# Altium schematic sheet Actuators.SchDoc
size A
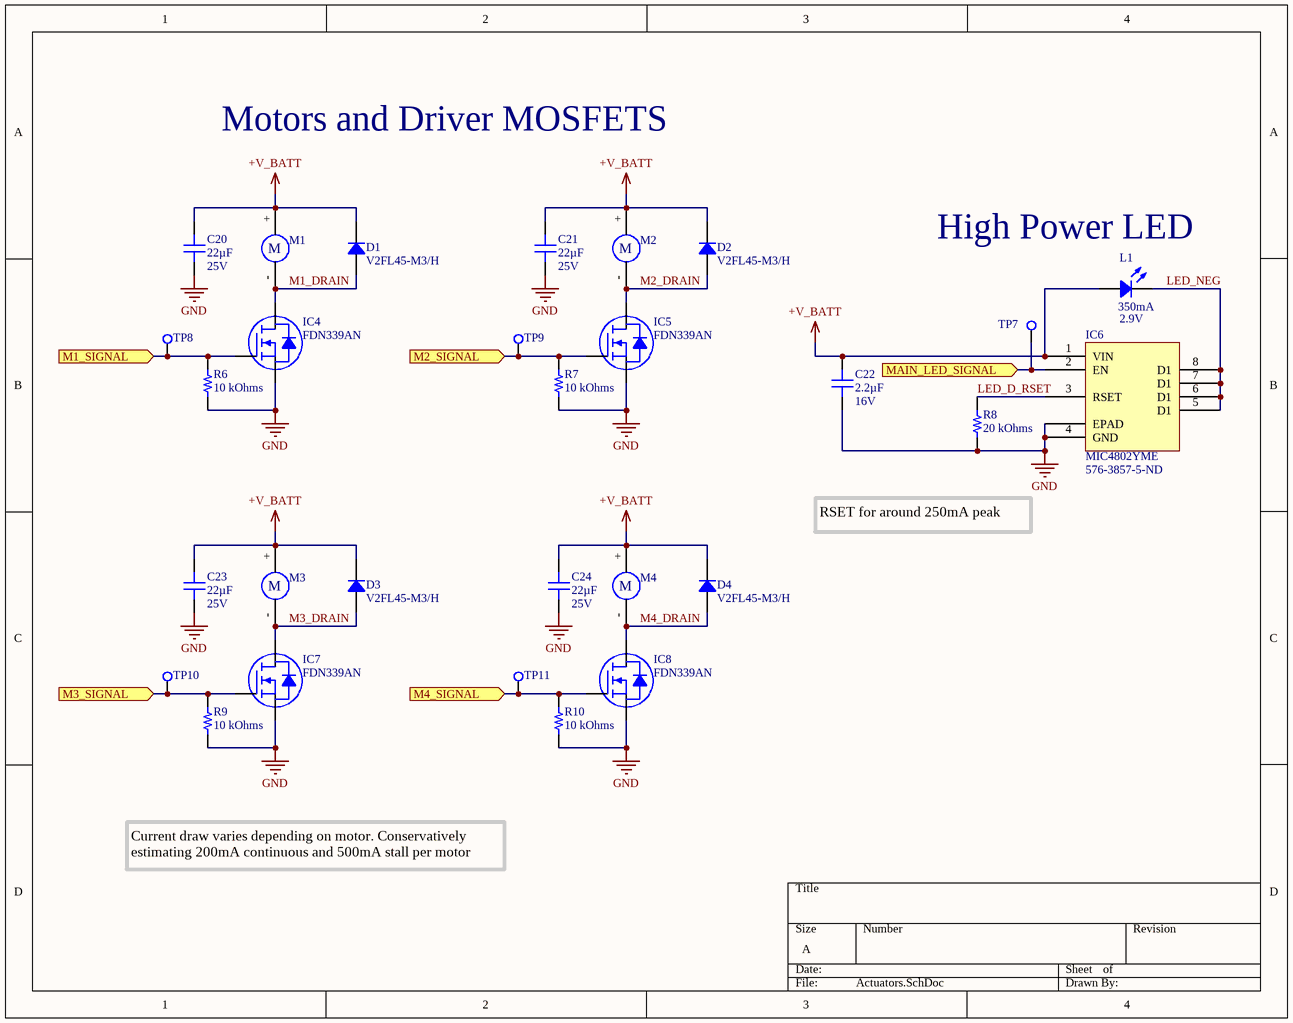
[diagram p0: Actuators.SchDoc]

## Parts
C20  Voltage - Rated: 25V  [CAP 1206_3216 - 1.8MM]  (hidden comment: 22µF)
C21  Voltage - Rated: 25V  [CAP 1206_3216 - 1.8MM]  (hidden comment: 22µF)
C22  Voltage - Rated: 16V  [CAP 0603_1608]  (hidden comment: 2.2µF)
C23  Voltage - Rated: 25V  [CAP 1206_3216 - 1.8MM]  (hidden comment: 22µF)
C24  Voltage - Rated: 25V  [CAP 1206_3216 - 1.8MM]  (hidden comment: 22µF)
D1  V2FL45-M3/H  [SMF DO-219AB]
D2  V2FL45-M3/H  [SMF DO-219AB]
D3  V2FL45-M3/H  [SMF DO-219AB]
D4  V2FL45-M3/H  [SMF DO-219AB]
IC4  FDN339AN  [ON SEMI SOT-23-3]
IC5  FDN339AN  [ON SEMI SOT-23-3]
IC6  MIC4802YME  Supplier Part Number 1: 576-3857-5-ND  [SOIC127P610X160_HS-9N]
IC7  FDN339AN  [ON SEMI SOT-23-3]
IC8  FDN339AN  [ON SEMI SOT-23-3]
L1  Test Current: 350mA  Forward Voltage: 2.9V  [LED]  (hidden comment: SCP9WTF1HEL1WKG34E)
M1  Motor Header  [Motor Header]  (value not drawn)  (no BOM)
M2  Motor Header  [Motor Header]  (value not drawn)  (no BOM)
M3  Motor Header  [Motor Header]  (value not drawn)  (no BOM)
M4  Motor Header  [Motor Header]  (value not drawn)  (no BOM)
R6  10 kOhms  [RES 0603_1608]
R7  10 kOhms  [RES 0603_1608]
R8  20 kOhms  [RES 0603_1608]
R9  10 kOhms  [RES 0603_1608]
R10  10 kOhms  [RES 0603_1608]
TP7  TestPoint  [TestPoint]  (value not drawn)  (no BOM)
TP8  TestPoint  [TestPoint]  (value not drawn)  (no BOM)
TP9  TestPoint  [TestPoint]  (value not drawn)  (no BOM)
TP10  TestPoint  [TestPoint]  (value not drawn)  (no BOM)
TP11  TestPoint  [TestPoint]  (value not drawn)  (no BOM)

## Ports
M1_SIGNAL (in), M2_SIGNAL (in), M3_SIGNAL (in), M4_SIGNAL (in), MAIN_LED_SIGNAL (in)

## Nets
+V_BATT: C20.2 C21.2 C22.2 C23.2 C24.2 D1.2 D2.2 D3.2 D4.2 IC6.1(VIN) L1.Anode M1.+ M2.+ M3.+ M4.+
GND: C20.1 C21.1 C22.1 C23.1 C24.1 IC4.2(S) IC5.2(S) IC6.4(GND) IC6.EPAD IC7.2(S) IC8.2(S) R6.1 R7.1 R8.1 R9.1 R10.1
LED_D_RSET: IC6.3(RSET) R8.2
LED_NEG: IC6.5(D1) IC6.6(D1) IC6.7(D1) IC6.8(D1) L1.Cathode
M1_DRAIN: D1.1 IC4.3(D) M1.-
M1_SIGNAL: IC4.1(G) R6.2 TP8.1 ; port M1_SIGNAL
M2_DRAIN: D2.1 IC5.3(D) M2.-
M2_SIGNAL: IC5.1(G) R7.2 TP9.1 ; port M2_SIGNAL
M3_DRAIN: D3.1 IC7.3(D) M3.-
M3_SIGNAL: IC7.1(G) R9.2 TP10.1 ; port M3_SIGNAL
M4_DRAIN: D4.1 IC8.3(D) M4.-
M4_SIGNAL: IC8.1(G) R10.2 TP11.1 ; port M4_SIGNAL
MAIN_LED_SIGNAL: IC6.2(EN) TP7.1 ; port MAIN_LED_SIGNAL

## Notes on the sheet
- Motors and Driver MOSFETS
- (near L1) High Power LED
- RSET for around 250mA peak
- Current draw varies depending on motor. Conservatively estimating 200mA continuous and 500mA stall per motor
- (in symbol Motor Header) M

## Library data of the parts
C20 C21 C23 C24 = C3216X5R1E226M160AB: CAP CER 22UF 25V X5R 1206; Manufacturer: TDK Corporation; Tolerance: ±20%; Part Number: C3216X5R1E226M160AB; Value: 22µF; Applications: General Purpose; Capacitance: 22µF; ComponentLink1Description: Datasheet; ComponentLink1URL: https://product.tdk.com/info/en/catalog/datasheets/mlcc_commercial_general_en.pdf?ref_disty=digikey; ComponentLink2Description: DigiKey Link; ComponentLink2URL: http://digikey.com/product-detail/en/tdk-corporation/C3216X5R1E226M160AB/445-6000-1-ND/2444041; Device Package: 1206 (3216 Metric); Features: Low ESL; LastUpdated: 9/2/2020 1:05:36 AM; Lifecycle Status: Active; Minimum Order: 1; Mounting Type: Surface Mount, MLCC; Operating Temperature: -55°C ~ 85°C; Package / Case: 1206 (3216 Metric); Packaging: TapeAndReel; PartId: 21231; Part Status: Active; Price: 0.35; Series: C; Size / Dimension: 0.126" L x 0.063" W (3.20mm x 1.60mm); Supplier 1: DigiKey; Supplier Part Number 1: 445-6000-1-ND; Temperature Coefficient: X5R; Thickness (Max): 0.071" (1.80mm)
C22 = CC0603KRX5R7BB225: CAP CER 2.2UF 16V X5R 0603; Manufacturer: Yageo; Tolerance: ±10%; Part Number: CC0603KRX5R7BB225; Value: 2.2µF; Applications: General Purpose; Capacitance: 2.2µF; ComponentLink1Description: Datasheet; ComponentLink1URL: https://www.yageo.com/upload/media/product/productsearch/datasheet/mlcc/UPY-GPHC_X5R_4V-to-50V_25.pdf; ComponentLink2Description: DigiKey Link; ComponentLink2URL: http://digikey.com/product-detail/en/yageo/CC0603KRX5R7BB225/311-1784-1-ND/5195686; Device Package: 0603 (1608 Metric); LastUpdated: 9/2/2020 1:03:11 AM; Lifecycle Status: Active; Minimum Order: 1; Mounting Type: Surface Mount, MLCC; Operating Temperature: -55°C ~ 85°C; Package / Case: 0603 (1608 Metric); Packaging: TapeAndReel; PartId: 15051; Part Status: Active; Price: 0.03; Series: CC; Size / Dimension: 0.063" L x 0.031" W (1.60mm x 0.80mm); Supplier 1: DigiKey; Supplier Part Number 1: 311-1784-1-ND; Temperature Coefficient: X5R; Thickness (Max): 0.035" (0.90mm)
D1-D4 = V2FL45-M3/H: 2A,45V,SMF,TRENCH SKY RECT.; Manufacturer: Vishay Semiconductor Diodes Division; Capacitance @ Vr, F: 270pF @ 4V, 1MHz; Current - Reverse Leakage @ Vr: 570µA @ 45V; Diode Type: Schottky; Speed: Fast Recovery =< 500ns, > 200mA (Io); Voltage - Forward (Vf) (Max) @ If: 560mV @ 2A; Part Number: V2FL45-M3/H; ComponentLink1Description: Datasheet; ComponentLink1URL: http://www.vishay.com/docs/87561/v2fl45.pdf; ComponentLink2Description: DigiKey Link; ComponentLink2URL: http://digikey.com/product-detail/en/vishay-semiconductor-diodes-division/V2FL45-M3-H/V2FL45-M3-HGICT-ND/9360081; Current - Average Rectified (Io): 2A; LastUpdated: 9/2/2020 1:23:14 AM; Lifecycle Status: Active; Minimum Order: 1; Mounting Type: Surface Mount; Operating Temperature - Junction: -40°C ~ 150°C; Package / Case: DO-219AB; Packaging: TapeAndReel; PartId: 1281; Part Status: Active; Price: 0.08; Series: eSMP®, TMBS®; Supplier 1: DigiKey; Supplier Part Number 1: V2FL45-M3/HGICT-ND; Supplier Device Package: DO-219AB (SMF); Voltage - DC Reverse (Vr) (Max): 45V
IC4 IC5 IC7 IC8 = FDN339AN: MOSFET N-CH 20V 3A SSOT3; Manufacturer: ON Semiconductor; Current - Continuous Drain (Id) @ 25°C: 3A (Ta); Drive Voltage (Max Rds On,  Min Rds On): 2.5V, 4.5V; FET Type: N-Channel; Gate Charge (Qg) (Max) @ Vgs: 10nC @ 4.5V; Input Capacitance (Ciss) (Max) @ Vds: 700pF @ 10V; Power Dissipation (Max): 500mW (Ta); Rds On (Max) @ Id, Vgs: 35mOhm @ 3A, 4.5V; Vgs (Max): ±8V; Vgs(th) (Max) @ Id: 1.5V @ 250µA; Part Number: FDN339AN; ComponentLink1Description: Datasheet; ComponentLink1URL: https://www.onsemi.com/pub/Collateral/FDN339AN-D.PDF; ComponentLink2Description: DigiKey Link; ComponentLink2URL: http://digikey.com/product-detail/en/on-semiconductor/FDN339AN/FDN339ANCT-ND/965603; Drain to Source Voltage (Vdss): 20V; LastUpdated: 9/2/2020 1:25:07 AM; Lifecycle Status: Active; Minimum Order: 1; Mounting Type: Surface Mount; Operating Temperature: -55°C ~ 150°C (TJ); Package / Case: TO-236-3, SC-59, SOT-23-3; Packaging: TapeAndReel; Part Status: Active; Price: 0.14; Series: PowerTrench®; Supplier 1: DigiKey; Supplier Part Number 1: FDN339ANCT-ND; Supplier Device Package: SuperSOT-3; Technology: MOSFET (Metal Oxide)
IC6 = MIC4802YME: MICREL SEMICONDUCTOR - MIC4802YME - LED DVR, 800MA, 1CH, 8SOIC; Manufacturer: Microchip; Supplier 1: Digi-Key; Manufacturer Part Number: MIC4802YME; RoHS: Yes; Category: LED Drivers; Stock 1: 593; Pricing 1: 1=0.90000, 25=0.75000, 100=0.68000 (USD); ComponentLink1URL: https://datasheet.ciiva.com/1604/1441850-1604702.pdf?src-supplier=Newark; ComponentLink1Description: https://datasheet.ciiva.com/1604/1441850-1604702.pdf?src-supplier=Newark; ComponentLink2URL: https://datasheet.ciiva.com/1946/mic4802-1946707.pdf?src-supplier=Digi-Key; ComponentLink2Description: https://datasheet.ciiva.com/1946/mic4802-1946707.pdf?src-supplier=Digi-Key; ComponentLink3URL: https://datasheet.ciiva.com/16351/mic4802-16351710.pdf?src-supplier=Future+Electronics; ComponentLink3Description: https://datasheet.ciiva.com/16351/mic4802-16351710.pdf?src-supplier=Future+Electronics
L1 = SCP9WTF1HEL1WKG34E: LED Lighting LH181B White, Warm 2700K 2.9V 350mA 120° 2-SMD, No Lead; Manufacturer: Samsung; Color Rendering Index (CRI): 90; Max Current Rating: 1.4A; Viewing Angle: 110°; Thermal Resistance of Package: 2°C/W; Supplier 1: Digi-Key; Manufacturer Part Number: SCP9WTF1HEL1WKG34E; RoHS: No; Category: LEDs; Stock 1: 12970; Pricing 1: 1=0.70000, 10=0.45900, 100=0.30060, 1000=0.23730 (USD); Mount: Surface Mount; Case/Package: SMD/SMT; Color: White; Packaging: Tape and Reel; ComponentLink1URL: https://cdn.samsung.com/led/file/resource/2018/08/Data_Sheet_LH181B_Rev.3.4.pdf?src-supplier=Digi-Key; ComponentLink1Description: https://cdn.samsung.com/led/file/resource/2018/08/Data_Sheet_LH181B_Rev.3.4.pdf?src-supplier=Digi-Key; Supplier Part Number 1: 1510-2252-1-ND; Correlated Color Temperature (CCT): 2700K
R6 R7 R9 R10 = AC0603FR-0710KL: RES SMD 10K OHM 1% 1/10W 0603; Manufacturer: Yageo; Power (Watts): 0.1W, 1/10W; Temperature Coefficient: ±100ppm/°C; Part Number: AC0603FR-0710KL; Value: 10 kOhms; ComponentLink1Description: Datasheet; ComponentLink1URL: https://www.yageo.com/upload/media/product/productsearch/datasheet/rchip/PYu-AC_51_RoHS_L_7.pdf; ComponentLink2Description: DigiKey Link; ComponentLink2URL: http://digikey.com/product-detail/en/yageo/AC0603FR-0710KL/311-10KLDCT-ND/2828135; Composition: Thick Film; Device Package: 0603 (1608 Metric); Features: Automotive AEC-Q200, Moisture Resistant; Height - Seated (Max): 0.022" (0.55mm); LastUpdated: 9/2/2020 1:09:58 AM; Lifecycle Status: Active; Minimum Order: 1; Number of Terminations: 2; Operating Temperature: -55°C ~ 155°C; Package / Case: 0603 (1608 Metric); Packaging: CutTape; PartId: 17347; Part Status: Active; Price: 0.10; Ratings: AEC-Q200; Resistance: 10 kOhms; Series: AC; Size / Dimension: 0.063" L x 0.031" W (1.60mm x 0.80mm); Supplier 1: DigiKey; Supplier Part Number 1: 311-10KLDCT-ND; Supplier Device Package: 0603; Tolerance: ±1%
R8 = AC0603FR-0720KL: RES SMD 20K OHM 1% 1/10W 0603; Manufacturer: Yageo; Power (Watts): 0.1W, 1/10W; Temperature Coefficient: ±100ppm/°C; Part Number: AC0603FR-0720KL; Value: 20 kOhms; ComponentLink1Description: Datasheet; ComponentLink1URL: https://www.yageo.com/upload/media/product/productsearch/datasheet/rchip/PYu-AC_51_RoHS_L_7.pdf; ComponentLink2Description: DigiKey Link; ComponentLink2URL: http://digikey.com/product-detail/en/yageo/AC0603FR-0720KL/YAG3577CT-ND/6006426; Composition: Thick Film; Device Package: 0603 (1608 Metric); Features: Automotive AEC-Q200, Moisture Resistant; Height - Seated (Max): 0.022" (0.55mm); LastUpdated: 9/2/2020 1:09:58 AM; Lifecycle Status: Active; Minimum Order: 1; Number of Terminations: 2; Operating Temperature: -55°C ~ 155°C; Package / Case: 0603 (1608 Metric); Packaging: CutTape; PartId: 17364; Part Status: Active; Price: 0.10; Ratings: AEC-Q200; Resistance: 20 kOhms; Series: AC; Size / Dimension: 0.063" L x 0.031" W (1.60mm x 0.80mm); Supplier 1: DigiKey; Supplier Part Number 1: YAG3577CT-ND; Supplier Device Package: 0603; Tolerance: ±1%